# Altium schematic sheet POWER.SchDoc
size 203 x 127 mm; SheetNumber: 2; SheetTotal: 4
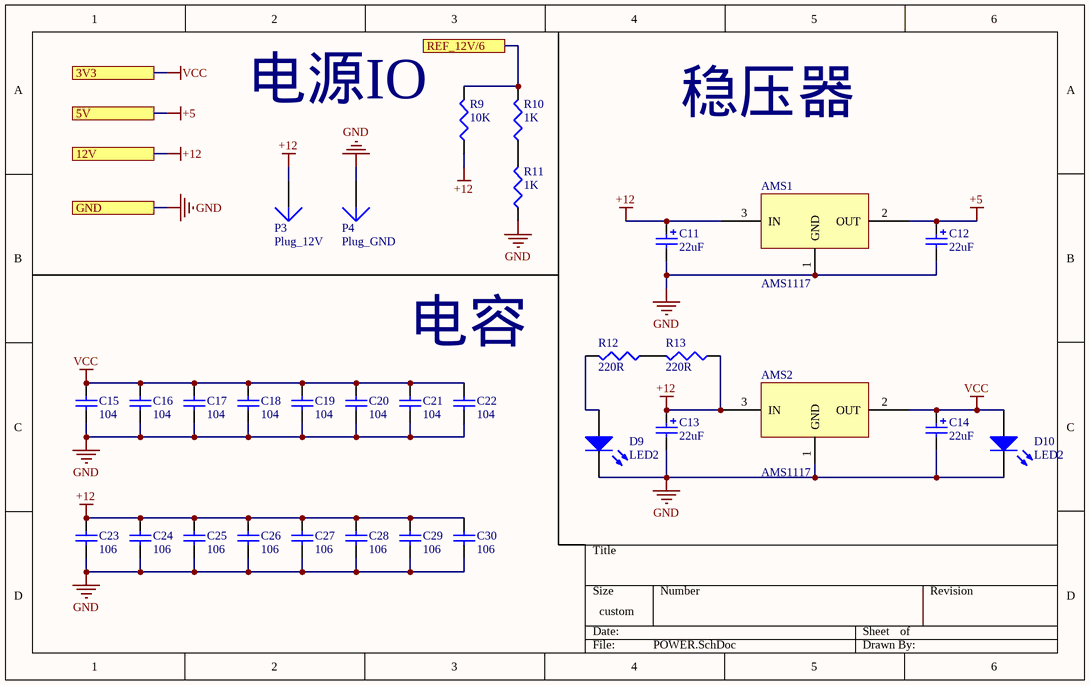
[diagram p0: POWER.SchDoc]

## Parts
AMS1  AMS1117  [AMS1117]
AMS2  AMS1117  [AMS1117]
C11  22uF  [MY0805]
C12  22uF  [MY0805]
C13  22uF  [MY0805]
C14  22uF  [MY0805]
C15  104  [MY0805]
C16  104  [MY0805]
C17  104  [MY0805]
C18  104  [MY0805]
C19  104  [MY0805]
C20  104  [MY0805]
C21  104  [MY0805]
C22  104  [MY0805]
C23  106  [MY0805]
C24  106  [MY0805]
C25  106  [MY0805]
C26  106  [MY0805]
C27  106  [MY0805]
C28  106  [MY0805]
C29  106  [MY0805]
C30  106  [MY0805]
D9  LED2  [MY0805]
D10  LED2  [MY0805]
P3  Plug_12V  [Hole_3MM]
P4  Plug_GND  [Hole_3MM]
R9  10K  [MY0805]
R10  1K  [MY0805]
R11  1K  [MY0805]
R12  220R  [MY0805]
R13  220R  [MY0805]

## Ports
3V3, 5V, 12V, GND, REF_12V/6

## Nets
+5: AMS1.2(OUT) C12.1 ; port 5V
+12: AMS1.3(IN) AMS2.3(IN) C11.1 C13.1 C23.2 C24.2 C25.2 C26.2 C27.2 C28.2 C29.2 C30.2 P3.1 R9.1 R13.1 ; port 12V
GND: AMS1.1(GND) AMS2.1(GND) C11.2 C12.2 C13.2 C14.2 C15.1 C16.1 C17.1 C18.1 C19.1 C20.1 C21.1 C22.1 C23.1 C24.1 C25.1 C26.1 C27.1 C28.1 C29.1 C30.1 D9.2(K) D10.2(K) P4.1 R11.1 ; port GND
VCC: AMS2.2(OUT) C14.1 C15.2 C16.2 C17.2 C18.2 C19.2 C20.2 C21.2 C22.2 D10.1(A) ; port 3V3
REF_12V/6: R9.2 R10.2 ; port REF_12V/6
NetD9_1: D9.1(A) R12.2
NetR10_1: R10.1 R11.2
NetR12_1: R12.1 R13.2

## Notes on the sheet
- 电源IO
- 稳压器
- 电容

## Library data of the parts
C11-C14 = Cap Pol2: Polarized Capacitor (Axial); Published: 8-Jun-2000; LatestRevisionDate: 17-Jul-2002; LatestRevisionNote: Re-released for DXP Platform.; PackageReference: POLAR0.8; Publisher: Altium Limited; PackageDescription: Polarized Capacitor; 2 Leads; Value: 22uF
C15-C30 = Cap: Capacitor; Published: 8-Jun-2000; LatestRevisionDate: 17-Jul-2002; LatestRevisionNote: Re-released for DXP Platform.; PackageReference: RAD-0.3; Publisher: Altium Limited; PackageDescription: Radial Cap, Thru-Hole; 2 Leads; 0.3 in Pin Spacing
  C15-C22: Value: 104
  C23-C30: Value: 106
D9 D10 = LED2: Typical RED, GREEN, YELLOW, AMBER GaAs LED; Published: 8-Jun-2000; LatestRevisionDate: 17-Jul-2002; LatestRevisionNote: Re-released for DXP Platform.; PackageVersion: Feb-2002; PackageReference: 3.2X1.6X1.1; Publisher: Altium Limited; PackageDescription: SM LED; 2 Flat Leads
P3 P4 = Plug: LatestRevisionDate: 17-Jul-2002; LatestRevisionNote: Re-released for DXP Platform.; Publisher: Altium Limited
R9-R11 = Res3: Resistor; Published: 8-Jun-2000; LatestRevisionDate: 29-May-2009; LatestRevisionNote: IPC-7351 Footprint Added.; PackageReference: J1-0603; Publisher: Altium Limited; PackageDescription: Chip Resistor
  R9: Value: 10K
  R10 R11: Value: 1K
R12 R13 = Res3: Resistor; Value: 1K; Published: 8-Jun-2000; LatestRevisionDate: 29-May-2009; LatestRevisionNote: IPC-7351 Footprint Added.; PackageReference: J1-0603; Publisher: Altium Limited; PackageDescription: Chip Resistor